# EAGLE schematic umodular_mix4 (EAGLE 7.2.0)

## Sheet 1 of 2
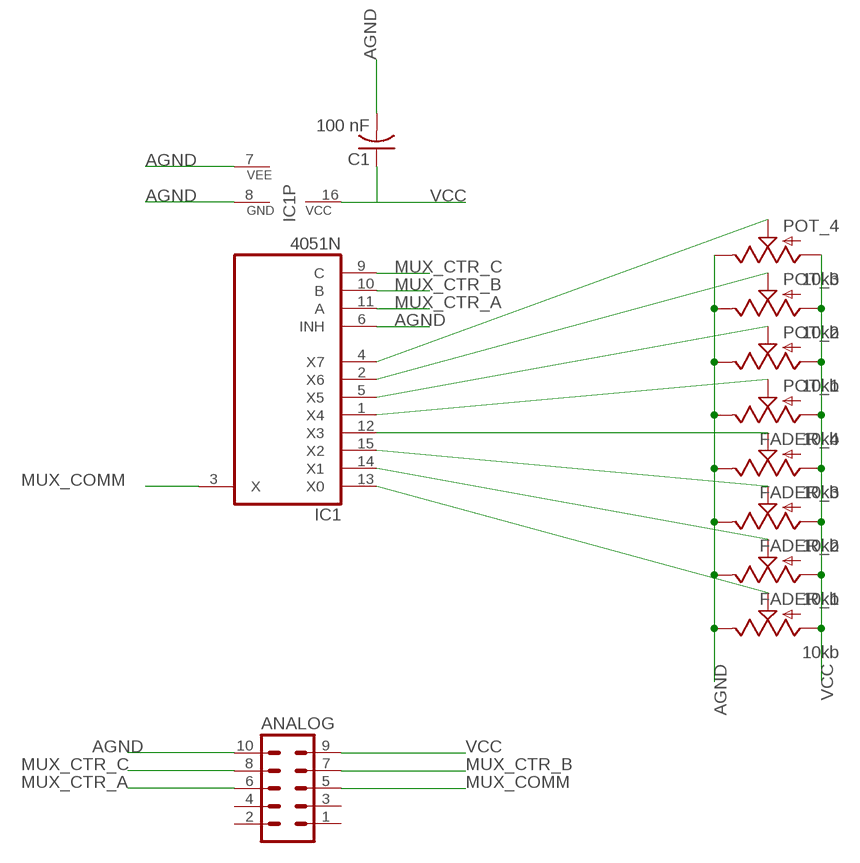
[diagram p0: schematic, sheet 1]

### Parts
ANALOG  MA05-2  [MA05-2]
C1  100 nF  C-US050-024X044  [C050-024X044]
FADER_1  10kb  SLIDER  [SLIDER]
FADER_2  10kb  SLIDER  [SLIDER]
FADER_3  10kb  SLIDER  [SLIDER]
FADER_4  10kb  SLIDER  [SLIDER]
IC1  4051N  [DIL16]
POT_1  10kb  POT  [ALPS_POT]
POT_2  10kb  POT  [ALPS_POT]
POT_3  10kb  POT  [ALPS_POT]
POT_4  10kb  POT  [ALPS_POT]

### Nets
AGND: ANALOG.10 C1.2 FADER_1.1 FADER_2.1 FADER_3.1 FADER_4.1 IC1.6(INH) IC1.7(VEE) IC1.8(GND) POT_1.P$1(E) POT_2.P$1(E) POT_3.P$1(E) POT_4.P$1(E)
MUX_COMM: ANALOG.5 IC1.3(X)
MUX_CTR_A: ANALOG.6 IC1.11(A)
MUX_CTR_B: ANALOG.7 IC1.10(B)
MUX_CTR_C: ANALOG.8 IC1.9(C)
N$274: FADER_1.2 IC1.13(X0)
N$275: FADER_2.2 IC1.14(X1)
N$276: FADER_3.2 IC1.15(X2)
N$277: FADER_4.2 IC1.12(X3)
N$278: IC1.1(X4) POT_1.P$2(S)
N$279: IC1.5(X5) POT_2.P$2(S)
N$280: IC1.2(X6) POT_3.P$2(S)
N$281: IC1.4(X7) POT_4.P$2(S)
VCC: ANALOG.9 C1.1 FADER_1.3 FADER_2.3 FADER_3.3 FADER_4.3 IC1.16(VCC) POT_1.P$3(A) POT_2.P$3(A) POT_3.P$3(A) POT_4.P$3(A) ; also sheet 2
Unconnected: ANALOG.1 ANALOG.2 ANALOG.3 ANALOG.4

## Sheet 2 of 2
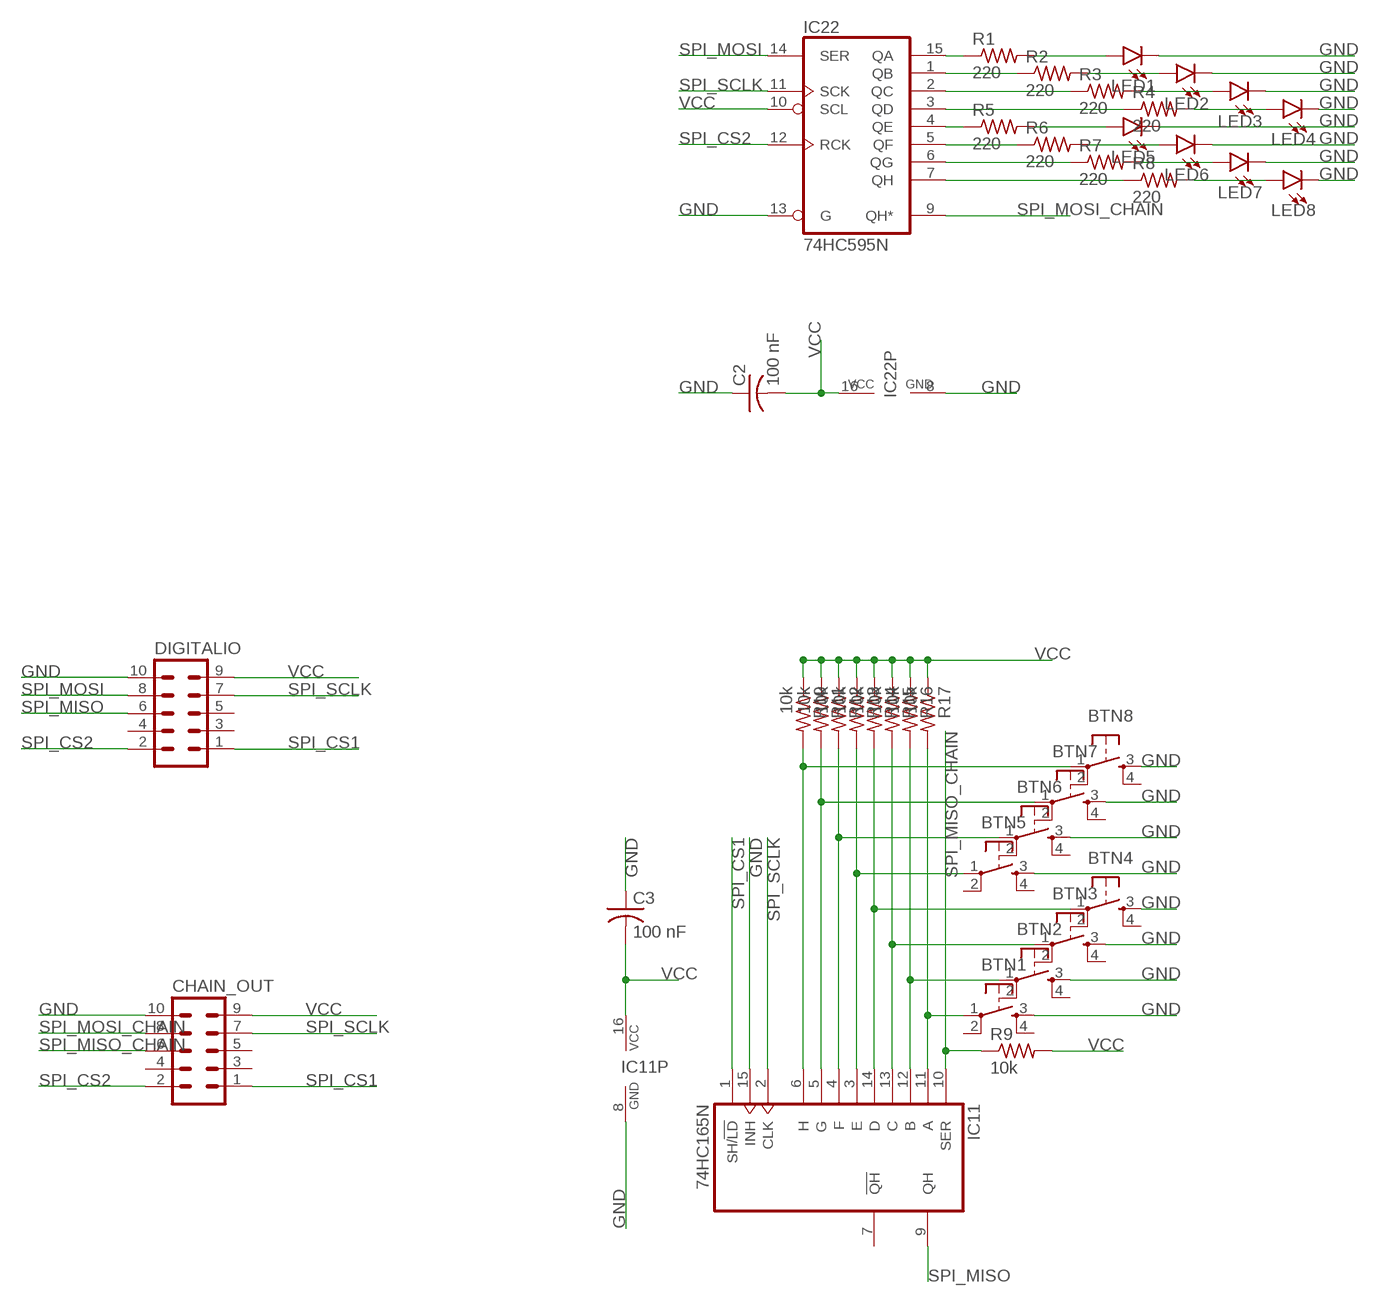
[diagram p1: schematic, sheet 2]

### Parts
BTN1  TAC_SWITCHPTH  [TACTILE-PTH]
BTN2  TAC_SWITCHPTH  [TACTILE-PTH]
BTN3  TAC_SWITCHPTH  [TACTILE-PTH]
BTN4  TAC_SWITCHPTH  [TACTILE-PTH]
BTN5  TAC_SWITCHPTH  [TACTILE-PTH]
BTN6  TAC_SWITCHPTH  [TACTILE-PTH]
BTN7  TAC_SWITCHPTH  [TACTILE-PTH]
BTN8  TAC_SWITCHPTH  [TACTILE-PTH]
C2  100 nF  C-US050-024X044  [C050-024X044]
C3  100 nF  C-US050-024X044  [C050-024X044]
CHAIN_OUT  MA05-2  [MA05-2]
DIGITALIO  MA05-2  [MA05-2]
IC11  74HC165N  [DIL16]
IC22  74HC595N  [DIL16]
LED1  LED3MM  [LED_3MM]
LED2  LED3MM  [LED_3MM]
LED3  LED3MM  [LED_3MM]
LED4  LED3MM  [LED_3MM]
LED5  LED3MM  [LED_3MM]
LED6  LED3MM  [LED_3MM]
LED7  LED3MM  [LED_3MM]
LED8  LED3MM  [LED_3MM]
R1  220  R-US_0204/7  [0204/7]
R2  220  R-US_0204/7  [0204/7]
R3  220  R-US_0204/7  [0204/7]
R4  220  R-US_0204/7  [0204/7]
R5  220  R-US_0204/7  [0204/7]
R6  220  R-US_0204/7  [0204/7]
R7  220  R-US_0204/7  [0204/7]
R8  220  R-US_0204/7  [0204/7]
R9  10k  R-US_0204/7  [0204/7]
R10  10k  R-US_0204/7  [0204/7]
R11  10k  R-US_0204/7  [0204/7]
R12  10k  R-US_0204/7  [0204/7]
R13  10k  R-US_0204/7  [0204/7]
R14  10k  R-US_0204/7  [0204/7]
R15  10k  R-US_0204/7  [0204/7]
R16  10k  R-US_0204/7  [0204/7]
R17  10k  R-US_0204/7  [0204/7]

### Nets
GND: BTN1.3 BTN2.3 BTN3.3 BTN4.3 BTN5.3 BTN6.3 BTN7.3 BTN8.3 C2.1 C3.1 CHAIN_OUT.10 DIGITALIO.10 IC11.8(GND) IC11.15(INH) IC22.8(GND) IC22.13(G) LED1.K(C) LED2.K(C) LED3.K(C) LED4.K(C) LED5.K(C) LED6.K(C) LED7.K(C) LED8.K(C)
N$2: BTN1.1 IC11.11(A) R17.2
N$3: BTN2.1 IC11.12(B) R16.2
N$4: BTN3.1 IC11.13(C) R15.2
N$5: BTN4.1 IC11.14(D) R14.2
N$6: BTN5.1 IC11.3(E) R13.2
N$7: BTN6.1 IC11.4(F) R12.2
N$8: BTN7.1 IC11.5(G) R11.2
N$9: BTN8.1 IC11.6(H) R10.2
N$75: IC22.7(QH) R8.1
N$76: IC22.6(QG) R7.1
N$77: IC22.5(QF) R6.1
N$78: IC22.4(QE) R5.1
N$79: IC22.3(QD) R4.1
N$80: IC22.2(QC) R3.1
N$81: IC22.1(QB) R2.1
N$82: IC22.15(QA) R1.1
N$83: LED1.A R1.2
N$84: LED2.A R2.2
N$85: LED4.A R4.2
N$86: LED3.A R3.2
N$87: LED5.A R5.2
N$88: LED6.A R6.2
N$89: LED7.A R7.2
N$90: LED8.A R8.2
SPI_CS1: CHAIN_OUT.1 DIGITALIO.1 IC11.1(SH/!LD)
SPI_CS2: CHAIN_OUT.2 DIGITALIO.2 IC22.12(RCK)
SPI_MISO: DIGITALIO.6 IC11.9(QH)
SPI_MISO_CHAIN: CHAIN_OUT.6 IC11.10(SER) R9.1
SPI_MOSI: DIGITALIO.8 IC22.14(SER)
SPI_MOSI_CHAIN: CHAIN_OUT.8 IC22.9(QH*)
SPI_SCLK: CHAIN_OUT.7 DIGITALIO.7 IC11.2(CLK) IC22.11(SCK)
VCC: C2.2 C3.2 CHAIN_OUT.9 DIGITALIO.9 IC11.16(VCC) IC22.10(SCL) IC22.16(VCC) R9.2 R10.1 R11.1 R12.1 R13.1 R14.1 R15.1 R16.1 R17.1 ; also sheet 1
Unconnected: BTN1.2 BTN1.4 BTN2.2 BTN2.4 BTN3.2 BTN3.4 BTN4.2 BTN4.4 BTN5.2 BTN5.4 BTN6.2 BTN6.4 BTN7.2 BTN7.4 BTN8.2 BTN8.4 CHAIN_OUT.3 CHAIN_OUT.4 CHAIN_OUT.5 DIGITALIO.3 DIGITALIO.4 DIGITALIO.5 IC11.7(!QH)

## Library data of the parts
ANALOG CHAIN_OUT DIGITALIO = con-lstb:MA05-2: PIN HEADER; OC_FARNELL: unknown; OC_NEWARK: unknown
BTN1-BTN8 = SparkFun-Electromechanical_mod:TAC_SWITCH: Momentary Switch Button commonly used for reset or general input. Spark Fun Electronics SKU : COM-00097 SMT- SWCH-08247
C1-C3 = rcl:C-US: CAPACITOR, American symbol
FADER_1-FADER_4 = slider60mm:SLIDER: Slide-type potentiometer- COM-9119
IC1 = 40xx:4051: 8-channel ANALOG MULTIPLEXER
IC11 = 74xx-eu:74*165: 8-bit parallel load SHIFT REGISTER
IC22 = 74xx-eu:74*595: 8-bit SHIFT REGISTER, output latch
LED1-LED8 = SparkFun-LED:LED: LED (Generic) Standard schematic elements and footprints for 5mm, 3mm, 1206, and 0603 sized LEDs. Generic LEDs with no color specified.; PROD_ID: DIO-08794
POT_1-POT_4 = SparkFun-Electromechanical_mod:POT
R1-R8 = rcl:R-US_: RESISTOR, American symbol
R9-R17 = resistor:R-US_: RESISTOR, American symbol